# Altium project Controller.PrjPcb
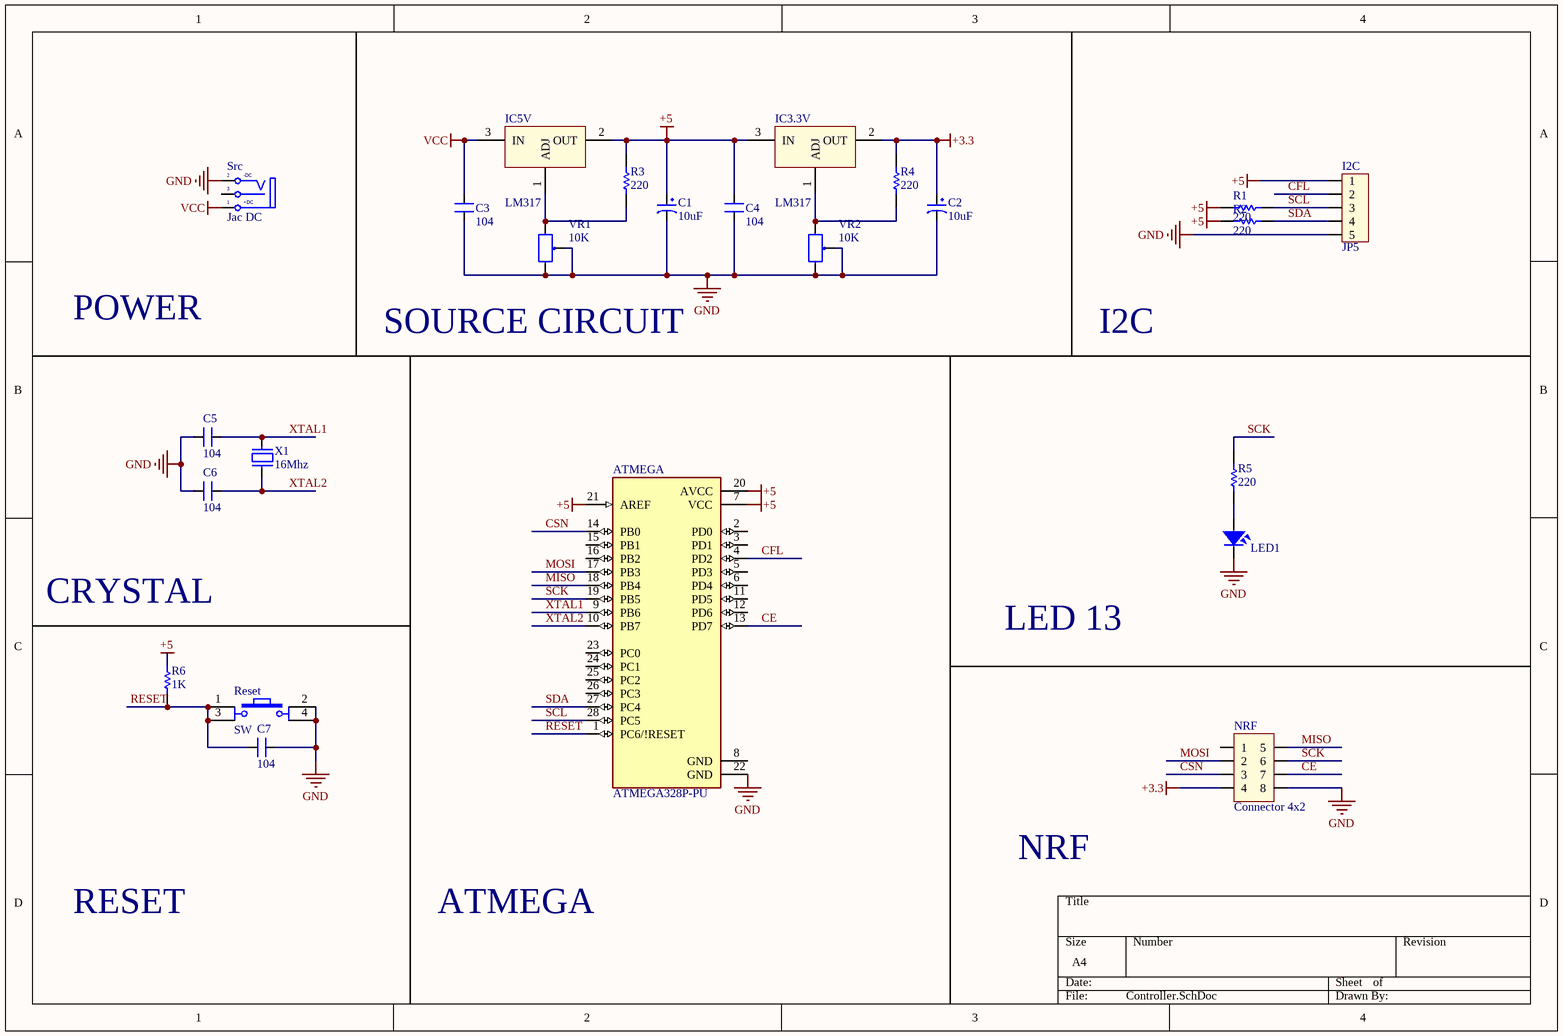
[diagram p0: Controller.SchDoc]
1 sheet, 24 parts. Net scope: global (net labels, ports and power ports of the same name join across sheets).
Board file: Controller.PcbDoc

## Sheet Controller.SchDoc
size A4

### Parts
ATMEGA  ATMEGA328P-PU  [DIP794W46P254L2967H457Q28B]
C1  10uF  [CP1/2]
C2  10uF  [CP1/2]
C3  104  [CN2]
C4  104  [CN2]
C5  104  [CN2]
C6  104  [CN2]
C7  104  [CN2]
I2C  JP5  [CON5]
IC3.3V  LM317  [QTO-220]
IC5V  LM317  [QTO-220]
LED1  LED  [LED-5-Green]  (value not drawn)
NRF  Connector 4x2  [JP4x2]
R1  value 220  [R1/4W]  (hidden comment: Res1)
R2  value 220  [R1/4W]  (hidden comment: Res1)
R3  value 220  [R1/4W]  (hidden comment: Res1)
R4  value 220  [R1/4W]  (hidden comment: Res1)
R5  value 220  [R1/4W]  (hidden comment: Res1)
R6  value 1K  [R1/4W]  (hidden comment: Res1)
Reset  SW  [SW4]
Src  Jac DC  [DC-IN]
VR1  10K  [VR]
VR2  10K  [VR]
X1  16Mhz  [XT2]

### Nets
+3.3: C2.1 IC3.3V.2(OUT) NRF.4 R4.1
+5: ATMEGA.7(VCC) ATMEGA.20(AVCC) ATMEGA.21(AREF) C1.1 C4.2 I2C.1 IC3.3V.3(IN) IC5V.2(OUT) R1.1 R2.1 R3.1 R6.2
GND: ATMEGA.22(GND) C1.2 C2.2 C3.1 C4.1 C5.1 C6.1 C7.2 I2C.5 LED1.2 NRF.8 Reset.2 Reset.4 Src.2(TN) VR1.2 VR1.3 VR2.2 VR2.3
VCC: C3.2 IC5V.3(IN) Src.1(T)
CE: ATMEGA.13(PD7) NRF.7
CFL: ATMEGA.4(PD2) I2C.2
CSN: ATMEGA.14(PB0) NRF.3
MISO: ATMEGA.18(PB4) NRF.5
MOSI: ATMEGA.17(PB3) NRF.2
RESET: ATMEGA.1(PC6/!RESET) C7.1 R6.1 Reset.1 Reset.3
SCK: ATMEGA.19(PB5) NRF.6 R5.1
SCL: ATMEGA.28(PC5) I2C.3 R1.2
SDA: ATMEGA.27(PC4) I2C.4 R2.2
XTAL1: ATMEGA.9(PB6) C5.2 X1.2
XTAL2: ATMEGA.10(PB7) C6.2 X1.1
NetIC3.3V_1: IC3.3V.1(ADJ) R4.2 VR2.1
NetIC5V_1: IC5V.1(ADJ) R3.2 VR1.1
NetLED1_1: LED1.1 R5.2

Not connected (* = marked no-connect by the designer): ATMEGA 2(PD0) 3(PD1) 5(PD3) 6(PD4) 8(GND) 11(PD5) 12(PD6) 15(PB1) 16(PB2) 23(PC0) 24(PC1) 25(PC2) 26(PC3); NRF 1; Src 3(S)

### Notes on the sheet
- POWER
- (near VR1) SOURCE CIRCUIT
- I2C
- CRYSTAL
- LED 13
- RESET
- ATMEGA
- NRF
- (in symbol DCIN) -DC; +DC

### Library data of the parts
ATMEGA = ATMEGA328P-PU: AVR AVRÂ® ATmega Microcontroller IC 8-Bit 20MHz 32KB _16K x 16_ FLASH 28-PDIP; MF: Microchip; Package: PDIP-28 Atmel; Value: *; Availability: Unavailable; SnapEDA_Link: https://www.snapeda.com/parts/ATMEGA328P-PU/Microchip/view-part/44282/?ref=snap; Price: None; MP: ATMEGA328P-PU
C1 C2 = CP1: Cap P  0,1uF < 22uF , 16 - 50V; Value: 10uF/50V; Description 1: 10 => 220uF/6,3V/10V - 10uF => 100uF/16V; Description 2: 0,1uF => 33uF/50V - 10uF => 22uF/63V; Description 3: 0,47uF => 10uF/100V
C3-C7 = CN2: Cap np 104 => 105pF; Value: 0.1uF
I2C = Con5: Connector 5; Value: Connector 5
IC3.3V IC5V = LM317: Adj Voltage +1.2 -> +37V; Value: LM317
LED1 = LED: LED Single colour Green and Red; Value: LED 3 ly Single Colour
NRF = JP4x2: Value: Connector 4x2
R1-R6 = Res1_1: Resistor; Manufacturer: Generic Components; Class: Passive; Published: 08/06/2000; Publisher: Altium Hobart Technology Centre; SubClass: Resistor
Reset = SW4: Switch button 4 pin; Value: Button chip 4 pin
Src = DCIN: Jac DC input; Value: Jac DC
VR1 VR2 = VR: Var Resistor; Value: VR 10K
X1 = XT2: Crystal For all Crystal 2pin.; Value: 4Mhz